# Altium schematic sheet 4-Antennas.SchDoc
size 594 x 420 mm; SheetNumber: 4; SheetTotal: 7; PageSetup: Record=PageOptions|CenterHorizontal=False|CenterVertical=False|PrintScale=0.43|XCorrection=0.00|YCorrection=0.00|PrintKind=1|BorderSize=5000000|LeftOffset=0|BottomOffset=0|Orientation=2|PaperLength=5940|PaperWidth=4200|Scale=100|PaperSource=7|PrintQuality=-4|MediaType=1|DitherType=10|PaperKind=Personal. 1: 215,9 x 279,4 mm|PrintScaleMode=0; NumTotalFolhas: 7; NumFolha: 4
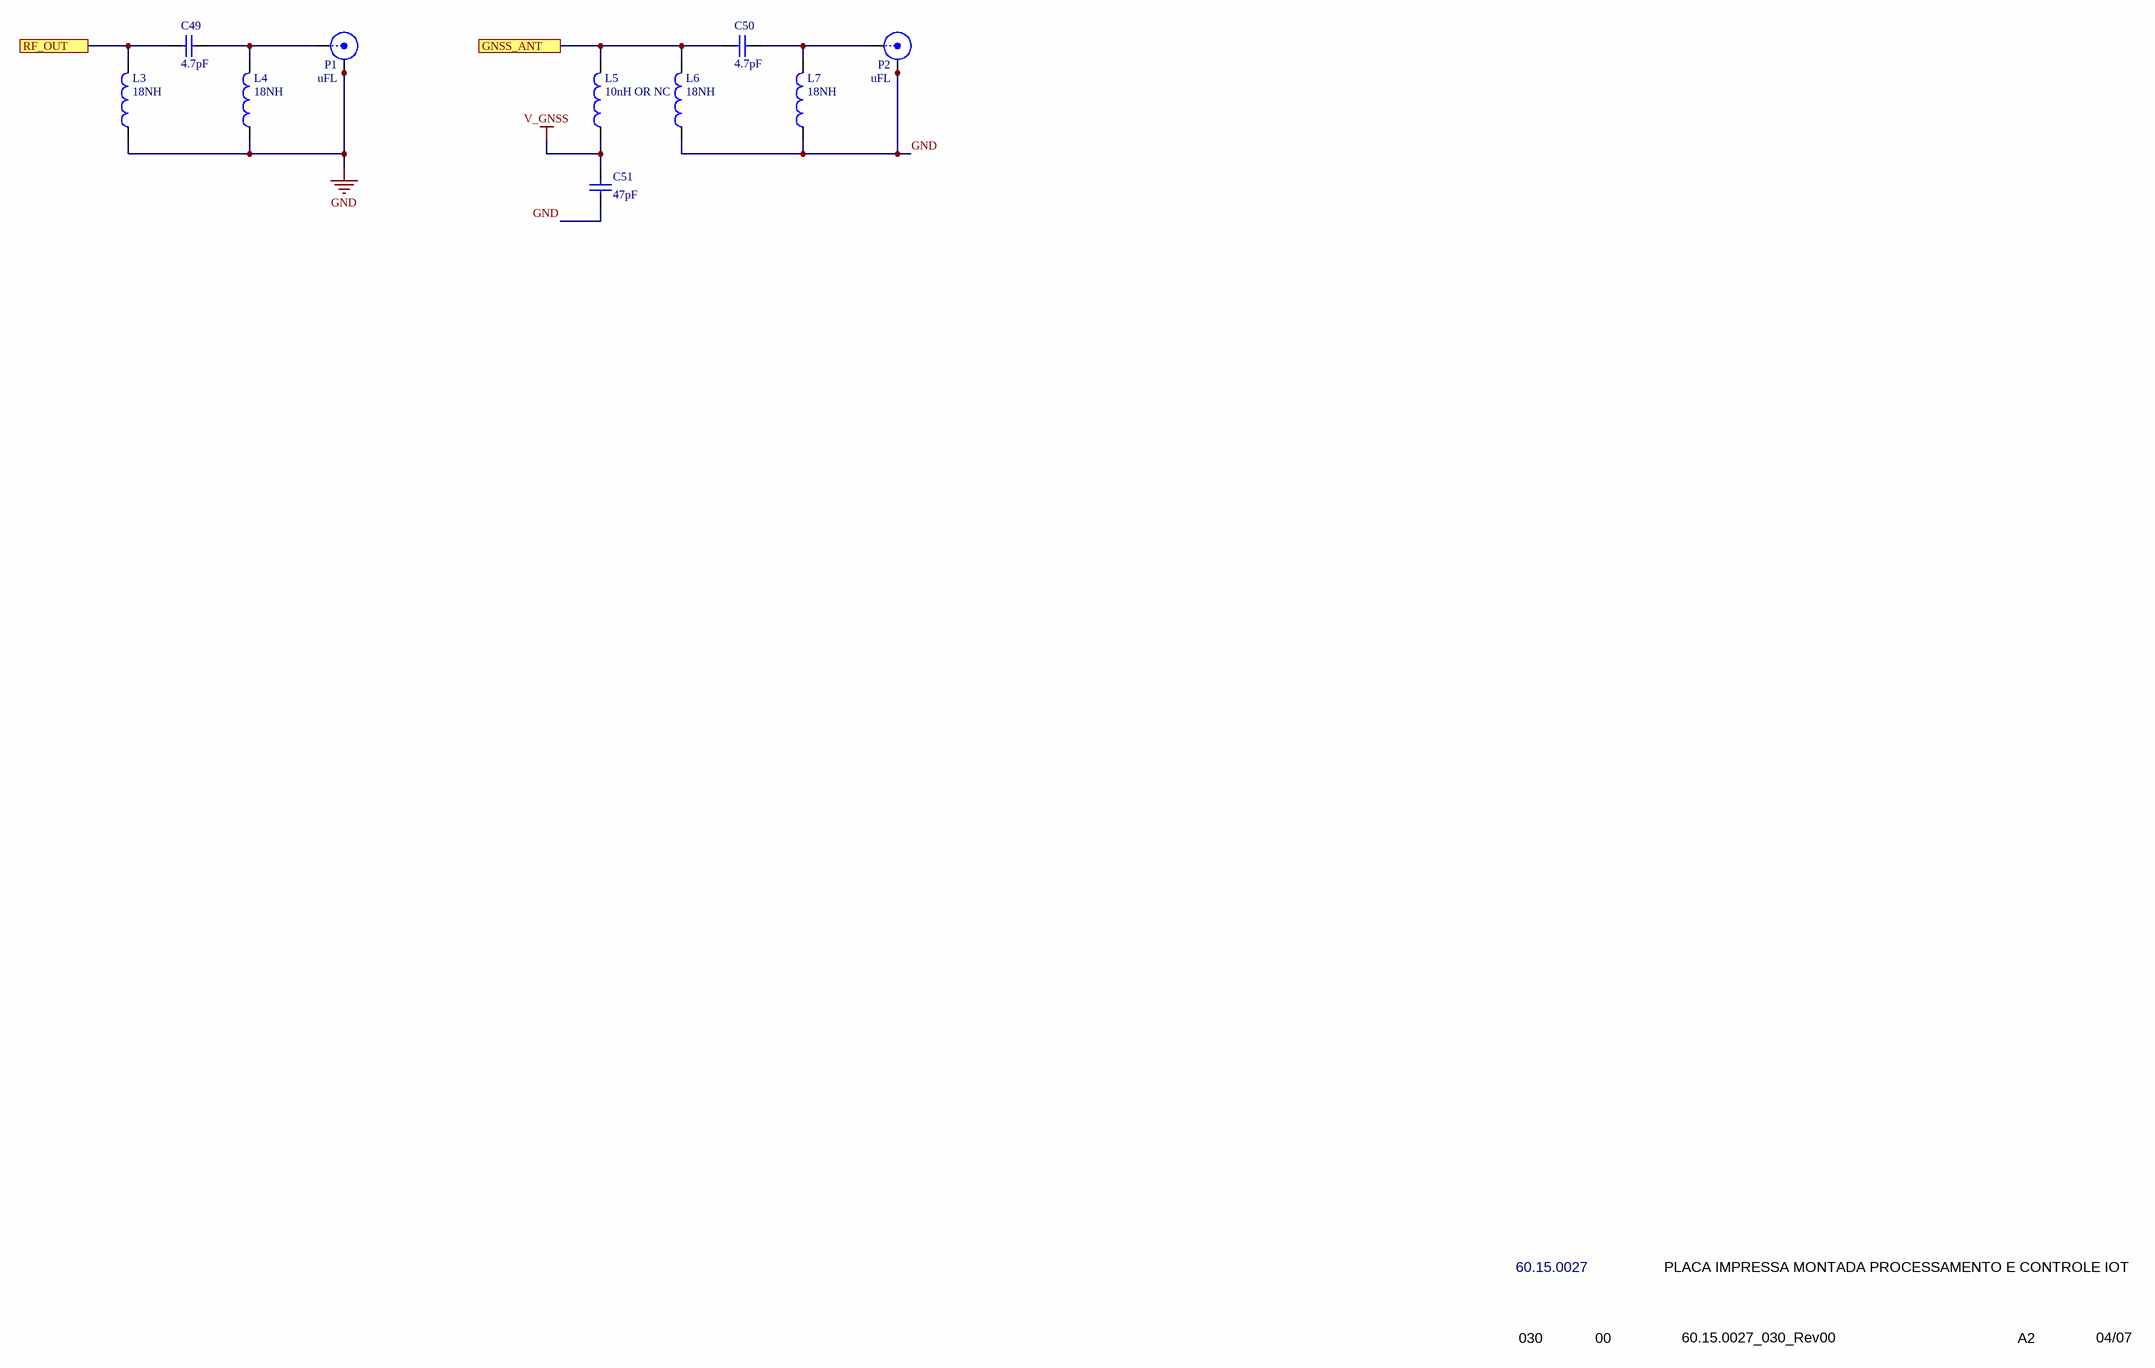
[diagram p0: 4-Antennas.SchDoc]

## Parts
C49  16.23.0788  [16.23.0788]  (value not drawn)
C50  16.23.0788  [16.23.0788]  (value not drawn)
C51  16.23.0798  [16.23.0798]  (value not drawn)
L3  value 18NH  [40.12.0345]  (hidden comment: 40.12.0345)
L4  value 18NH  [40.12.0345]  (hidden comment: 40.12.0345)
L5  value 10nH OR NC  [40.12.0348]  (hidden comment: 40.12.0348)
L6  value 18NH  [40.12.0345]  (hidden comment: 40.12.0345)
L7  value 18NH  [40.12.0345]  (hidden comment: 40.12.0345)
P1  value uFL  [28.20.0019]  (hidden comment: 28.20.0019)
P2  value uFL  [28.20.0019]  (hidden comment: 28.20.0019)

## Ports
GNSS_ANT, RF_OUT

## Nets
GND: C51.1 L3.1 L4.1 L6.1 L7.1 P1.2(GND) P1.3(GND) P2.2(GND) P2.3(GND)
V_GNSS: C51.2 L5.1
GNSS_ANT: C50.2 L5.2 L6.2 ; port GNSS_ANT
RF_OUT: C49.2 L3.2 ; port RF_OUT
NetC49_1: C49.1 L4.2 P1.1(SIG)
NetC50_1: C50.1 L7.2 P2.1(SIG)

## Notes on the sheet
- 60.15.0027
- PLACA IMPRESSA MONTADA PROCESSAMENTO E CONTROLE IOT
- 030
- 00
- 60.15.0027_030_Rev00
- A2
- 04/07
- 1
- 2
- 3
- 4
- 5
- 6
- 7
- 8
- A
- B
- C
- D
- E
- F
- G
- H
- DOCUMENTO DE ENGENHARIA DE PRODUTO
- DOCUMENT OF PRODUCT ENGINEERING
- CÓDIGO / CODE
- DESCRIÇÃO / DESCRIPTION
- DOC
- REV
- ARQUIVO / FILE
- FORM./SIZE
- FOLHA / PAGE
- (in symbol 16.23.0788) 4.7pF
- (in symbol 16.23.0798) 47pF

## Library data of the parts
C49 C50 = 16.23.0788: CAPACITOR CERAMICO MULTICAMADA 4.7PF 50V C0G/NP0 0402
C51 = 16.23.0798: CAPACITOR CERAMICO 47pF 10V 5% C0G SMD 0201
L3 L4 L6 L7 = 40.12.0345: INDUTOR FIXO 18NH 370MA 270 MOHM 0402
L5 = 40.12.0348: INDUTOR FIXO 10nH 3% 500mA 260mOHM 0402; Manufactor: MURATA; Part Number: LQG15HS10NH02D
P1 P2 = 28.20.0019: CONECTOR MICRO COAXIAL 50 OHM SMD